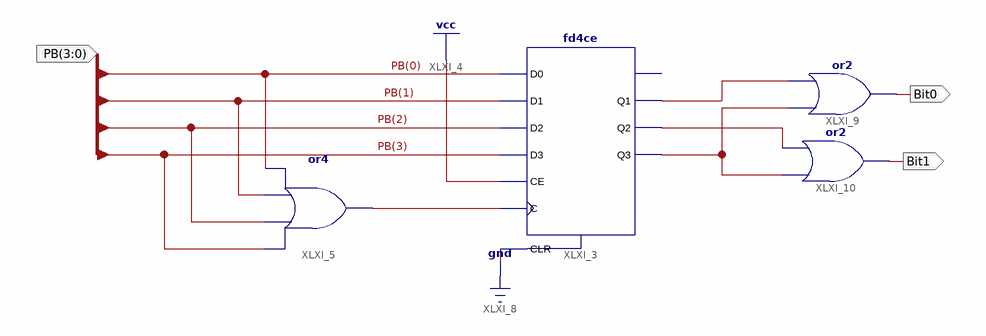
[diagram p0: schematic sheet 1]
// Xilinx ISE schematic encode_4_to_2.sch (spartan6) as structural Verilog: 4 symbols, 3 ports
module encode_4_to_2 (
  input  [3:0] PB,
  output Bit0,
  output Bit1
);

  wire XLXN_7, XLXN_17, XLXN_18, XLXN_19;

  fd4ce XLXI_3 (
    .C(XLXN_7), .CE(1'b1), .CLR(1'b0), .D0(PB[0]), .D1(PB[1]), .D2(PB[2]), .D3(PB[3]), .Q1(XLXN_17),
    .Q2(XLXN_18), .Q3(XLXN_19));  // open: Q0
  or XLXI_5 (XLXN_7, PB[3], PB[2], PB[1], PB[0]);
  or XLXI_9 (Bit0, XLXN_19, XLXN_17);
  or XLXI_10 (Bit1, XLXN_19, XLXN_18);
endmodule
